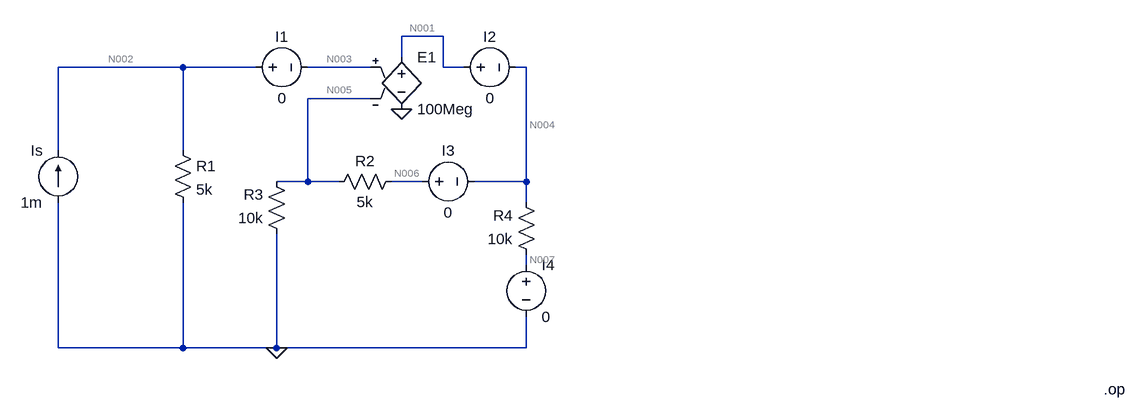
[diagram p0: schematic HW05P02.asc]
HW05P02.asc, the LTspice schematic file:
Version 4
SHEET 1 1664 680
WIRE 608 -64 544 -64
WIRE 544 -32 544 -64
WIRE 208 -16 16 -16
WIRE 320 -16 208 -16
WIRE 496 -16 400 -16
WIRE 608 -16 608 -64
WIRE 640 -16 608 -16
WIRE 736 -16 720 -16
WIRE 496 32 400 32
WIRE 16 112 16 -16
WIRE 208 112 208 -16
WIRE 400 160 400 32
WIRE 400 160 352 160
WIRE 448 160 400 160
WIRE 576 160 528 160
WIRE 736 160 736 -16
WIRE 736 160 656 160
WIRE 736 192 736 160
WIRE 736 288 736 272
WIRE 16 416 16 192
WIRE 208 416 208 192
WIRE 208 416 16 416
WIRE 352 416 352 240
WIRE 352 416 208 416
WIRE 736 416 736 368
WIRE 736 416 352 416
FLAG 544 48 0
FLAG 352 416 0
DATAFLAG 736 -16 ""
DATAFLAG 208 -16 ""
SYMBOL current 16 192 R180
WINDOW 0 24 80 Left 2
WINDOW 3 24 0 Left 2
SYMATTR InstName Is
SYMATTR Value 1m
SYMBOL res 192 96 R0
SYMATTR InstName R1
SYMATTR Value 5k
SYMBOL voltage 304 -16 R270
WINDOW 0 32 56 VTop 2
WINDOW 3 -32 56 VBottom 2
SYMATTR InstName I1
SYMATTR Value 0
SYMBOL e 544 -48 R0
SYMATTR InstName E1
SYMATTR Value 100Meg
SYMBOL voltage 624 -16 R270
WINDOW 0 32 56 VTop 2
WINDOW 3 -32 56 VBottom 2
SYMATTR InstName I2
SYMATTR Value 0
SYMBOL res 544 144 R90
WINDOW 0 0 56 VBottom 2
WINDOW 3 32 56 VTop 2
SYMATTR InstName R2
SYMATTR Value 5k
SYMBOL res 368 256 R180
WINDOW 0 36 76 Left 2
WINDOW 3 36 40 Left 2
SYMATTR InstName R3
SYMATTR Value 10k
SYMBOL res 752 288 R180
WINDOW 0 36 76 Left 2
WINDOW 3 36 40 Left 2
SYMATTR InstName R4
SYMATTR Value 10k
SYMBOL voltage 560 160 R270
WINDOW 0 32 56 VTop 2
WINDOW 3 -32 56 VBottom 2
SYMATTR InstName I3
SYMATTR Value 0
SYMBOL voltage 736 272 R0
SYMATTR InstName I4
SYMATTR Value 0
TEXT 1624 480 Left 2 !.op

The netlist it stands for:
* HW05P02.asc
Is 0 N002 1m
R1 N002 0 5k
V§I1 N002 N003 0
E1 N001 0 N003 N005 100Meg
V§I2 N001 N004 0
R2 N006 N005 5k
R3 0 N005 10k
R4 N007 N004 10k
V§I3 N006 N004 0
V§I4 N007 0 0
.op
.backanno
.end

* Results of the author's LTspice run, read from the files saved beside the schematic
* Operating Point:
*   V(n002) = 5 V
*   V(n003) = 5 V
*   V(n001) = 7.5 V
*   V(n005) = 5 V
*   V(n004) = 7.5 V
*   V(n006) = 7.5 V
*   V(n007) = 0 V
*   I(Is) = 1 mA
*   I(R1) = 1 mA
*   I(R2) = 500 µA
*   I(R3) = -500 µA
*   I(R4) = -750 µA
*   I(E1) = -1.25 mA
*   I(I1) = 0 A
*   I(I2) = 1.25 mA
*   I(I3) = -500 µA
*   I(I4) = 750 µA